# EasyEDA Pro project OSC1.eprj, board 信号调节电路
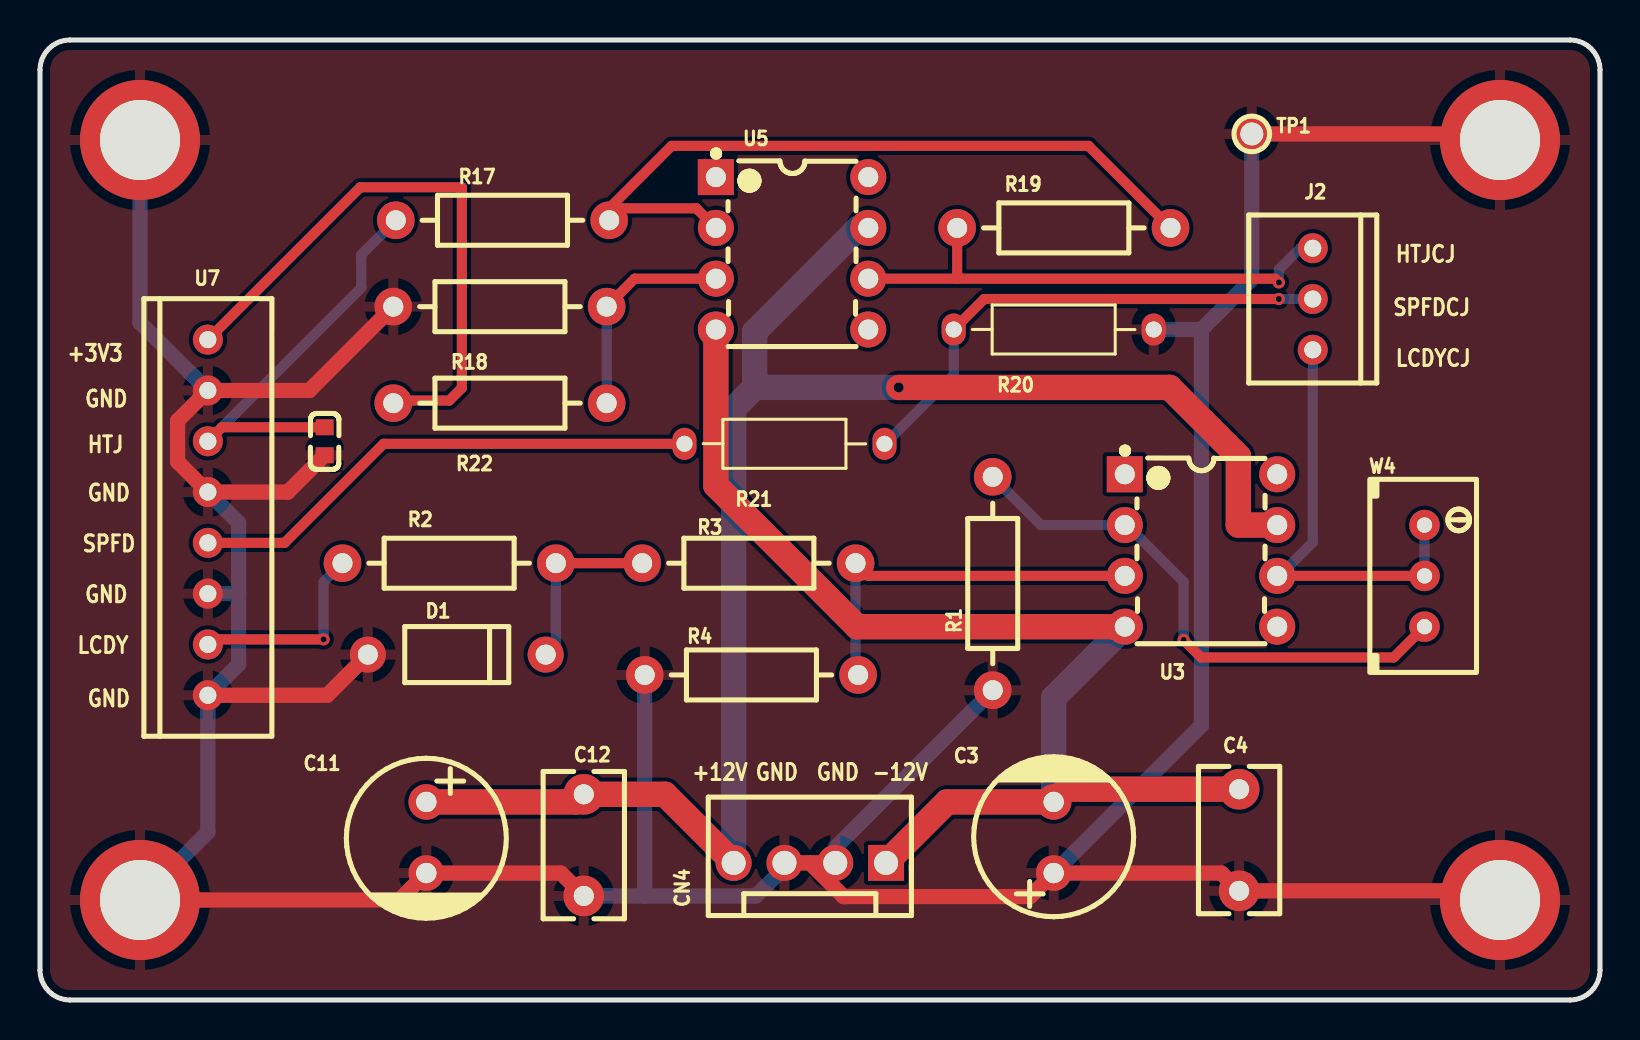
[diagram p7: board, top side]
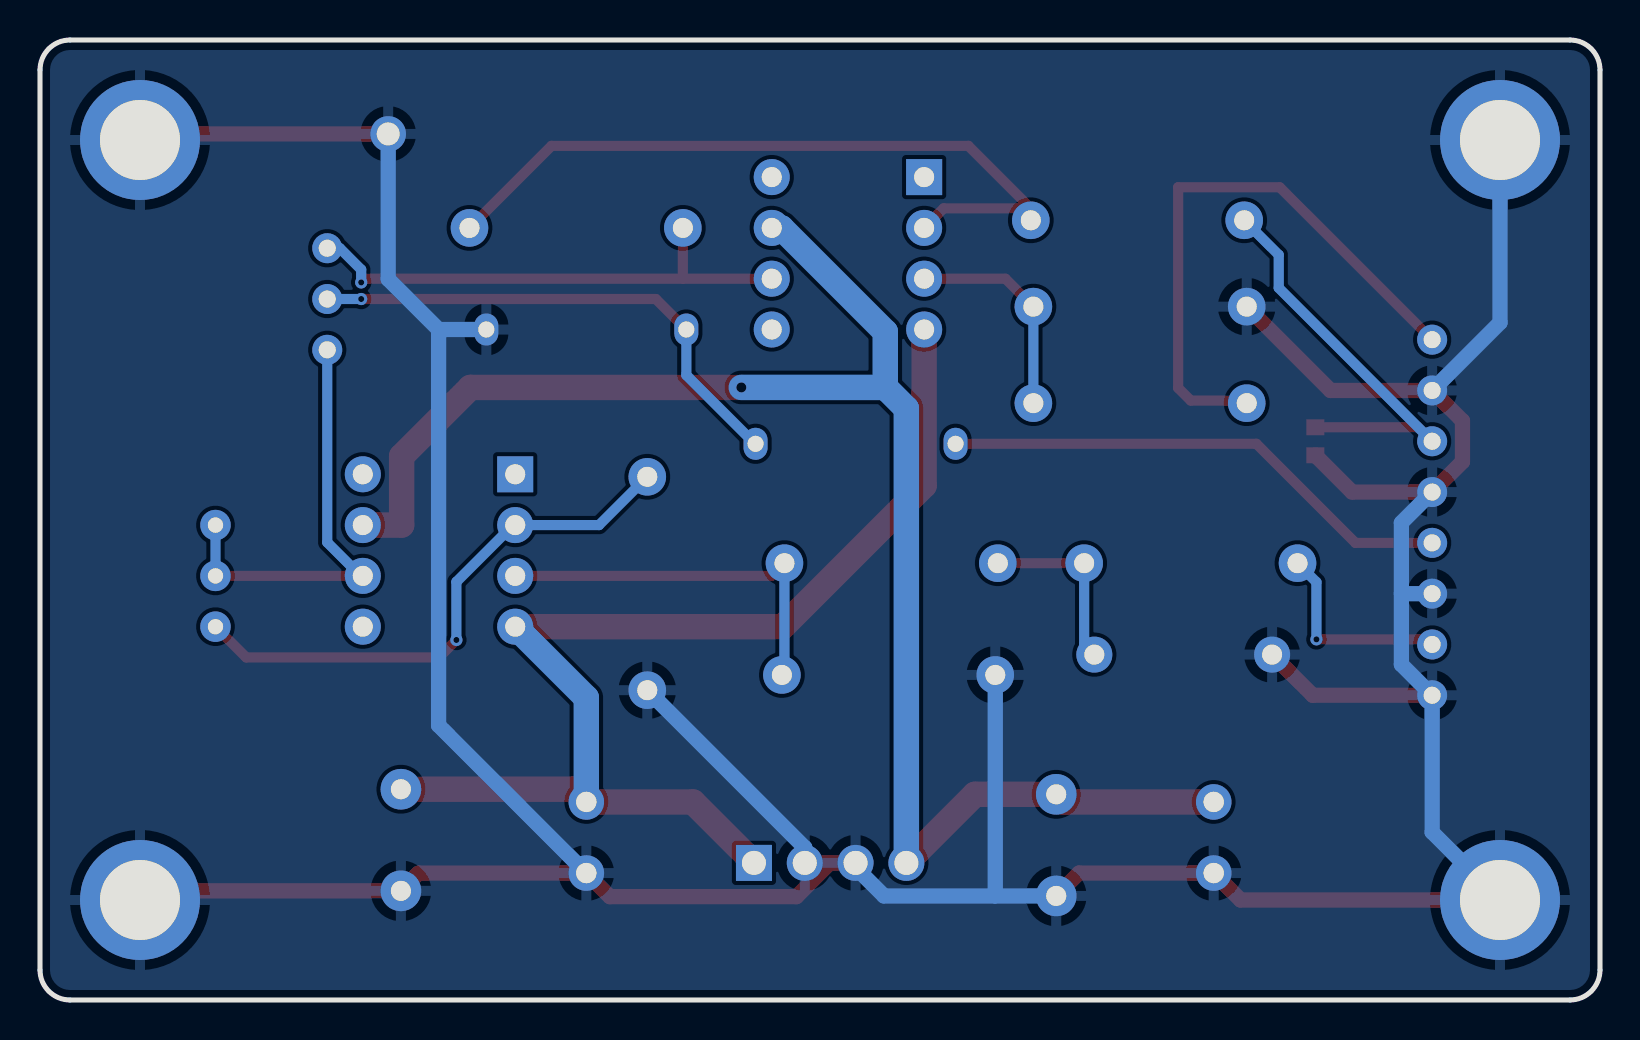
[diagram p8: board, bottom side, seen from below]

Outline 78 x 48 mm; copper layers: Top Layer, Bottom Layer. Coordinates in mm from the lower left corner of the outline.
Outline path: 0,46.5 0,1.5 arc(0.44,0.44) 1.5,0 76.5,0 arc(77.56,0.44) 78,1.5 78,46.5 arc(77.56,47.56) 76.5,48 1.5,48 arc(0.44,47.56) 0,46.5
Stack: Top Layer 0.035mm / Dielectric1 1.51mm FR4 er 4.5 / Bottom Layer 0.035mm

## Design rules (mm)
template: 自定义配置
spacing copperThickness1oz (default): track to track 0.203, other pairs 0.203 to 0.203
spacing copperThickness2oz: track to track 0.203, other pairs 0.152 to 0.3
track width copperThickness1oz (default): min 0.127, default 0.254, max 2.54
track width 5VandGND: min 0.254, default 0.762, max 2.54
track width 12V: min 0.254, default 1.27, max 2.54
differential pair differentialPair (default): width min 0.127, default 0.254, max 2.54; gap min 0.152, default 0.152
via viaSize (default): diameter min 0.5, default 0.61, max 10; hole min 0.3, default 0.305, max 6.299

## Placement (name value [footprint] x y rotation side)
C3  16V/470uF  [CAP-TH_BD8.0-P3.50-D0.6-FD]  50.68 8.12 90 top
C4  104  [cap-th_l7.2-w4.0-p5.00-d0.5]  59.96 8 90 top
C11  16V/470uF  [CAP-TH_BD8.0-P3.50-D0.6-FD]  19.31 8.12 270 top
C12  104  [cap-th_l7.2-w4.0-p5.00-d0.5]  27.19 7.74 270 top
C13  330nF  [C0603]  14.23 27.94 90 top
CN4  12V电源  [CONN-TH_4P-P2.54_A2510S-4P]  38.49 6.86 180 top
D1  1N4007  [DO-41_BD2.4-L4.7-P8.70-D0.9-RD]  20.84 17.27 180 top
J2  -  [CH2.54-3插座]  63.64 35.05 270 top
NOREF  -  [Pad_e1390]  5 5 0 top
NOREF#2  -  [Pad_e1533]  73 5 0 top
NOREF#3  -  [Pad_e1532]  73 43 0 top
NOREF#4  -  [Pad_e1389]  5 43 0 top
R1  1kΩ  [RES-TH_BD2.5-L6.5-P10.50-D0.6]  47.64 20.83 270 top
R2  5.1kΩ  [RES-TH_BD2.5-L6.5-P10.50-D0.6]  20.46 21.84 180 top
R3  10kΩ  [RES-TH_BD2.5-L6.5-P10.50-D0.6]  35.44 21.84 180 top
R4  2.7kΩ  [RES-TH_BD2.5-L6.5-P10.50-D0.6]  35.57 16.25 0 top
R17  2kΩ  [RES-TH_BD2.5-L6.5-P10.50-D0.6]  23.12 38.99 180 top
R18  1kΩ  [RES-TH_BD2.5-L6.5-P10.50-D0.6]  23 34.67 0 top
R19  1kΩ  [RES-TH_BD2.5-L6.5-P10.50-D0.6]  51.19 38.61 0 top
R20  4.2KΩ  [240*80mil]  50.68 33.53 180 top
R21  10KΩ  [240*80mil]  37.22 27.81 180 top
R22  2kΩ  [RES-TH_BD2.5-L6.5-P10.50-D0.6]  23 29.84 180 top
TP1  GND  [TESTPOINT-TH_BD3.2]  60.59 43.3 0 top
U3  OP07  [DIP-8_L8.8-W6.4-P2.54-LS7.6-BL]  58.05 22.48 270 top
U5  OP07  [DIP-8_L8.8-W6.4-P2.54-LS7.6-BL]  37.6 37.34 270 top
U7  -  [CH2.54-8 插座]  8.39 24.13 90 top
W4  1kΩ  [RES-ADJ-TH_3296W]  69.23 21.21 0 top

## Footprints (pads in the part's own frame, mm; a bottom-side part is the same pattern mirrored in y, then rotated)
240*80mil
  oval 1.2x1.6 hole 0.8: 1(-5,0) 2(5,0)
C0603
  rect 0.8x0.9 smd: 1(-0.7,0) 2(0.7,0)
CAP-TH_BD8.0-P3.50-D0.6-FD
  round 1.778 hole 1.016: 1(-1.778,0) 2(1.778,0)
cap-th_l7.2-w4.0-p5.00-d0.5
  round 2.032 hole 1.001: 1(-2.54,0) 2(2.54,0)
CH2.54-3插座
  round 1.5 hole 0.85: 1(-2.54,0) 2(0,0) 3(2.54,0)
CH2.54-8 插座
  round 1.5 hole 0.85: 1(-8.89,0) 2(-6.35,0) 3(-3.81,0) 4(-1.27,0) 5(1.27,0) 6(3.81,0) 7(6.35,0) 8(8.89,0)
CONN-TH_4P-P2.54_A2510S-4P
  rect 1.8x1.8 hole 1.2: 1(-3.81,0)
  round 1.8 hole 1.2: 2(-1.27,0) 3(1.27,0) 4(3.81,0)
DIP-8_L8.8-W6.4-P2.54-LS7.6-BL
  rect 1.801x1.801 hole 1.001: 1(-3.81,-3.81)
  round 1.801 hole 1.001: 2(-1.27,-3.81) 3(1.27,-3.81) 4(3.81,-3.81) 5(3.81,3.81) 6(1.27,3.81) 7(-1.27,3.81) 8(-3.81,3.81)
DO-41_BD2.4-L4.7-P8.70-D0.9-RD
  round 1.8 hole 1: 1(-4.445,0) 2(4.445,0)
Pad_e1389
  round 6 hole 4: 1(0,0)
Pad_e1390
  round 6 hole 4: 3(0,0)
Pad_e1532
  round 6 hole 4: 2(0,0)
Pad_e1533
  round 6 hole 4: 4(0,0)
RES-ADJ-TH_3296W
  round 1.524 hole 0.762: 1(0,2.54) 2(0,0) 3(0,-2.54)
RES-TH_BD2.5-L6.5-P10.50-D0.6
  round 1.879 hole 1: 1(-5.334,0) 2(5.334,0)
TESTPOINT-TH_BD3.2
  round 1.778 hole 1.143: 1(0,0)

## Nets
As in the schematic, except:
GND: C3.1 C4.1 C11.2 C12.2 C13.1 CN4.2 CN4.3 D1.2 NOREF.3 NOREF#2.4 NOREF#3.2 NOREF#4.1 R1.2 R4.1 R18.1 R20.1 TP1.1 U7.1 U7.3 U7.5 U7.7

Pads without a net: U3 1 5 8; U5 1 5 8

## Via types
v1: diameter 0.9, hole 0.5, Top Layer to Bottom Layer, 1 via
v2: diameter 0.61, hole 0.305, Top Layer to Bottom Layer, 4 vias

## Routing (per net, layer and track width the routed paths; a pad name or vN(x,y) marks a point on that pad's centre or on a via; arc(x,y) is an arc through that point)
+3V3: length 29.6
  Top Layer w0.508: R22.2 17.79,29.97 20.46,29.97 21.09,30.6 21.09,40.64 16.01,40.64 U7.8
+12V: length 82.8
  Top Layer w1.27: CN4.4 31.25,10.28 C12.1 26.81,9.9 C11.1 ; v1(42.93,30.63) 56.48,30.63 59.92,27.19 59.92,23.75 U3.7
  Bottom Layer w1.27: CN4.4 34.68,29.58 35.74,30.63 ; U5.7 40.93,38.61 35.74,33.41 35.74,30.63 ; v1(42.93,30.63) 35.74,30.63
-12V: length 60.6
  Top Layer w1.27: C4.2 51.32,10.54 C3.2 45.35,9.9 CN4.1 ; U3.4 40.85,18.67 33.79,25.73 U5.4
  Bottom Layer w1.27: C3.2 50.68,15.11 U3.4
GND: length 223.1
  Top Layer w0.762: U7.1 14.36,15.24 D1.2 ; R18.1 13.47,30.48 U7.7 6.88,28.96 6.88,26.91 U7.5 12.39,25.4 C13.1 ; 37.22,6.86 38.49,6.86 ; 38.49,6.86 CN4.2 ; 38.49,6.86 40.18,5.17 49.5,5.17 C3.1 59.07,6.35 C4.1 72.54,5.46 NOREF#2.4 ; C12.2 26.05,6.35 C11.2 17.97,5 NOREF.3 ; NOREF#3.2 72.7,43.3 TP1.1
  Bottom Layer w0.762: C3.1 58.07,13.73 58.07,33.53 ; CN4.2 39.76,7.62 R1.2 ; 58.07,33.53 R20.1 ; 58.07,33.53 60.59,36.05 TP1.1 ; 37.22,6.86 37.22,6.63 35.8,5.2 30.24,5.2 ; C12.2 30.24,5.2 ; 30.24,5.2 R4.1 ; 9.93,20.32 U7.3 ; 9.93,20.32 9.93,16.77 U7.1 8.39,8.39 NOREF.3 ; 9.93,20.32 9.93,23.86 U7.5 ; NOREF#4.1 5,33.87 U7.7
HTJ: length 21.1
  Top Layer w0.508: C13.2 9.09,28.64 U7.6
  Bottom Layer w0.508: R17.2 16.06,37.26 16.06,35.61 U7.6
HTJCJ: length 25.9
  Top Layer w0.508: 45.86,36.07 U5.6 ; 45.86,36.07 R19.1 ; 45.86,36.07 61.75,36.07 v2(61.94,35.88)
  Bottom Layer w0.508: v2(61.94,35.88) 61.94,36.52 63.01,37.59 J2.1
LCDY: length 10.1
  Top Layer w0.508: U7.2 8.65,18.03 v2(14.18,18.03)
  Bottom Layer w0.508: R2.2 14.18,20.9 v2(14.18,18.03)
LCDYCJ: length 22
  Top Layer w0.508: W4.2 U3.6
  Bottom Layer w0.508: U3.6 61.96,21.21 63.64,22.88 J2.3 ; W4.2 W4.1
SPFD: length 25.9
  Top Layer w0.508: R21.2 17.18,27.81 12.23,22.86 U7.4
SPFDCJ: length 25.7
  Top Layer w0.508: v2(61.94,35.05) 47.21,35.05 R20.2
  Bottom Layer w0.508: R21.1 42.25,27.81 45.68,31.25 R20.2 ; v2(61.94,35.05) J2.2
$2N682: length 9.1
  Top Layer w0.508: 30.11,21.84 R2.1
  Bottom Layer w0.508: R2.1 25.79,17.78 D1.1
$2N687: length 19.4
  Top Layer w0.508: U3.3 41.41,21.21 R3.1
  Bottom Layer w0.508: R3.1 40.78,16.38 R4.2
$2N689: length 27.7
  Top Layer w0.508: W4.3 67.69,17.13 58.05,17.13 v2(57.18,18)
  Bottom Layer w0.508: R1.1 50.05,23.75 U3.2 54.34,23.75 57.18,20.91 v2(57.18,18)
$2N1428: length 37.4
  Top Layer w0.508: R17.1 28.46,39.58 ; 28.46,39.58 31.58,42.71 52.43,42.71 R19.2 ; 28.46,39.58 32.81,39.58 U5.2
$2N5063: length 10.9
  Top Layer w0.508: U5.3 29.73,36.07 R18.2
  Bottom Layer w0.508: R18.2 R22.1

## Copper pours and planes (outline as drawn; the poured copper is in the pictures)
GND on Top Layer: -10.53,65.53 89.16,65.53 89.16,-15.75 -10.53,-15.75
GND on Bottom Layer: -9.7,64.77 87.51,64.77 87.51,-15.37 -9.7,-15.37

## Text on the board
Top Silkscreen Layer: +3V3 | LCDY | SPFD | GND | HTJ | +12V | -12V | SPFDCJ | HTJCJ | LCDYCJ
